# Altium schematic sheet 401_RPi0.SchDoc: RPi Zero Wireless
size A2; Organization: Greenfield Tech Solutions; Address1: Molendreef 33; Address2: Ossendrecht; Address3: 4641CS; Address4: The Netherlands; SheetNumber: 5; SheetTotal: 8
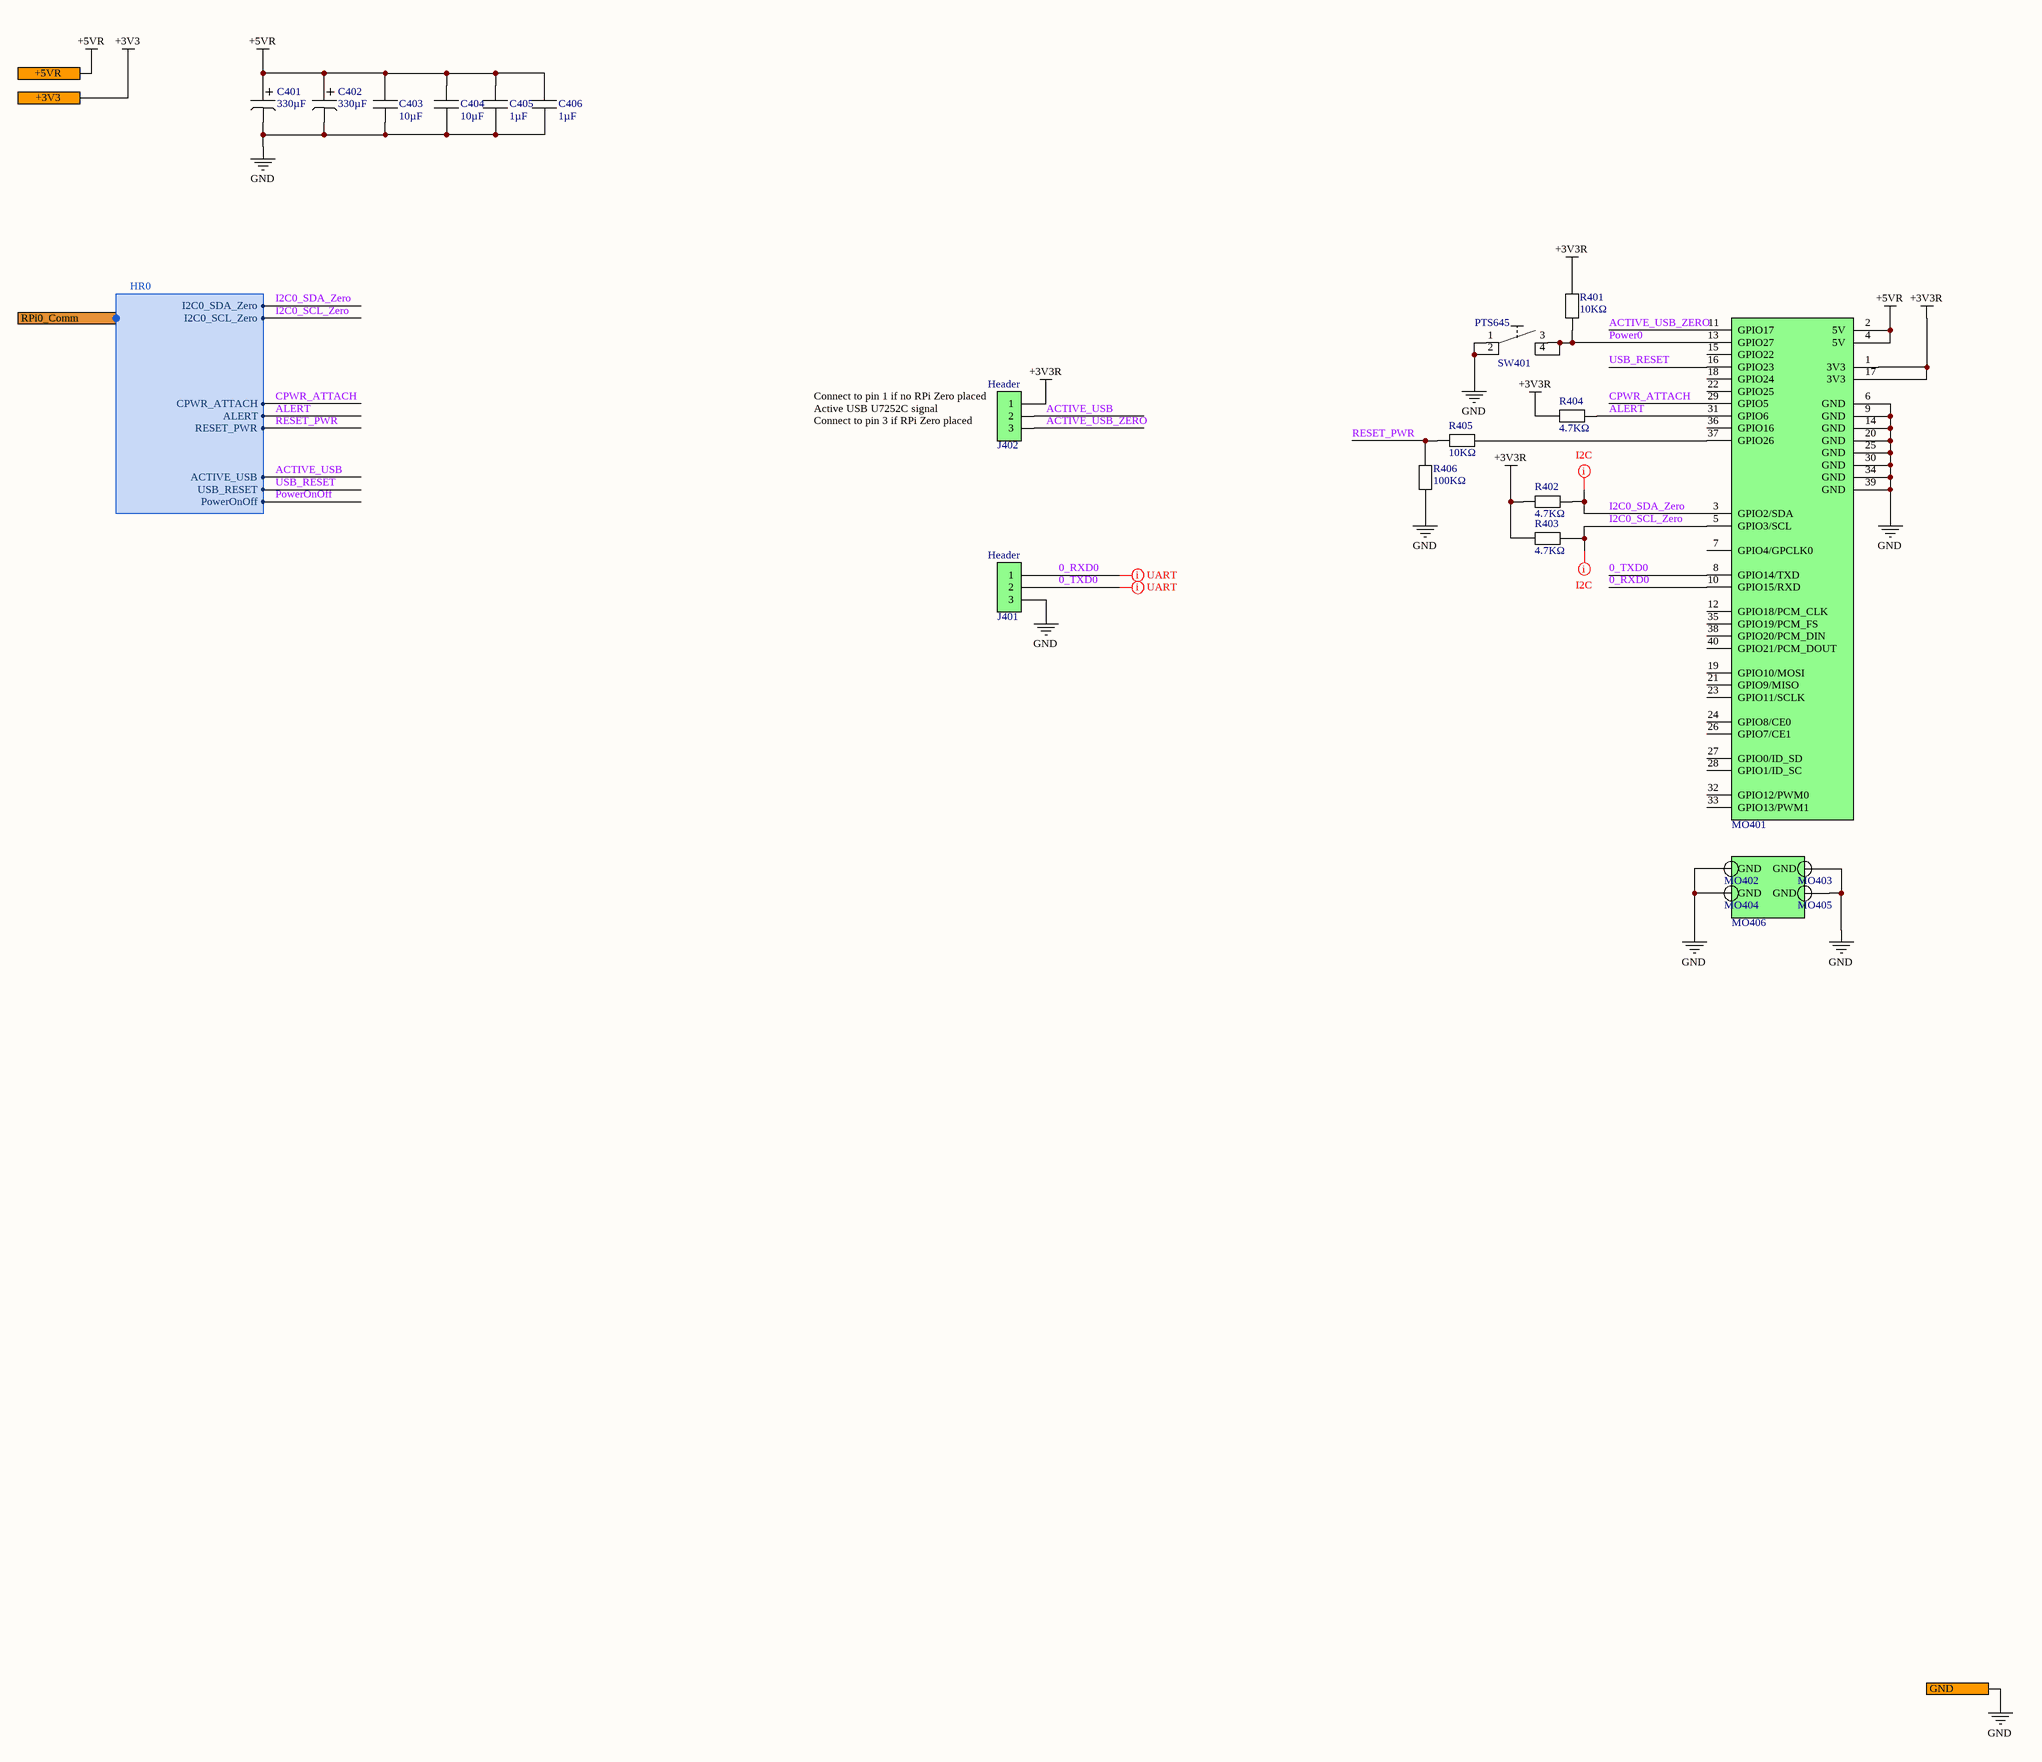
[diagram p0: 401_RPi0.SchDoc]

## Parts
C401  330µF  [EC_E7]
C402  330µF  [EC_E7]
C403  10µF  [C0805]
C404  10µF  [C0805]
C405  1µF  [C0603]
C406  1µF  [C0603]
J401  Header  [1X3P_2.54mm]
J402  Header  [1X3P_2.54mm]
MO401  ZeroW-1  [RPIZeroW_HeaderPins]  (value not drawn)
MO402  ZeroW-M  [CM4-M]  (value not drawn)
MO403  ZeroW-M  [CM4-M]  (value not drawn)
MO404  ZeroW-M  [CM4-M]  (value not drawn)
MO405  ZeroW-M  [CM4-M]  (value not drawn)
MO406  ZeroW  [RPIZeroW_Layout_Heightened]  (value not drawn)
R401  10KΩ  [R0402]
R402  4.7KΩ  [R0603]
R403  4.7KΩ  [R0603]
R404  4.7KΩ  [R0603]
R405  10KΩ  [R0402]
R406  100KΩ  [R0402]
SW401  PTS645  [PTS645-V]

## Ports
+3V3, +5VR, GND, RPi0_Comm (harness HR0)

## Harnesses
HR0: I2C0_SCL_Zero, I2C0_SDA_Zero, CPWR_ATTACH, PowerOnOff, USB_RESET, ACTIVE_USB, ALERT, RESET_PWR

## Nets
+3V3: port +3V3
+3V3R: J402.1 MO401.1(3V3) MO401.17(3V3) R401.2 R402.1 R403.1 R404.1
+5VR: C401.1 C402.1 C403.1 C404.1 C405.1 C406.1 MO401.2(5V) MO401.4(5V) ; port +5VR
GND: C401.2 C402.2 C403.2 C404.2 C405.2 C406.2 J401.3 MO401.6(GND) MO401.9(GND) MO401.14(GND) MO401.20(GND) MO401.25(GND) MO401.30(GND) MO401.34(GND) MO401.39(GND) MO402.GND MO403.GND MO404.GND MO405.GND R406.1 SW401.1 SW401.2 ; port GND
0_RXD0: J401.1 MO401.10(GPIO15/RXD)
0_TXD0: J401.2 MO401.8(GPIO14/TXD)
ACTIVE_USB: J402.2 ; port RPi0_Comm.ACTIVE_USB
ACTIVE_USB_ZERO: J402.3 MO401.11(GPIO17)
ALERT: MO401.31(GPIO6) R404.2 ; port RPi0_Comm.ALERT
CPWR_ATTACH: MO401.29(GPIO5) ; port RPi0_Comm.CPWR_ATTACH
I2C0_SCL_Zero: MO401.5(GPIO3/SCL) R403.2 ; port RPi0_Comm.I2C0_SCL_Zero
I2C0_SDA_Zero: MO401.3(GPIO2/SDA) R402.2 ; port RPi0_Comm.I2C0_SDA_Zero
Power0: MO401.13(GPIO27) R401.1 SW401.3 SW401.4
PowerOnOff: port RPi0_Comm.PowerOnOff
RESET_PWR: R405.1 R406.2 ; port RPi0_Comm.RESET_PWR
USB_RESET: MO401.16(GPIO23) ; port RPi0_Comm.USB_RESET
NetMO401_37: MO401.37(GPIO26) R405.2

Not connected (* = marked no-connect by the designer): MO401 7(GPIO4/GPCLK0) 12(GPIO18/PCM_CLK) 15(GPIO22) 18(GPIO24) 19(GPIO10/MOSI) 21(GPIO9/MISO) 22(GPIO25) 23(GPIO11/SCLK) 24(GPIO8/CE0) 26(GPIO7/CE1) 27(GPIO0/ID_SD) 28(GPIO1/ID_SC) 32(GPIO12/PWM0) 33(GPIO13/PWM1) 35(GPIO19/PCM_FS) 36(GPIO16) 38(GPIO20/PCM_DIN) 40(GPIO21/PCM_DOUT)

## Layout directives
net class I2C_0: I2C0_SCL_Zero, I2C0_SDA_Zero
net class UART_0: 0_RXD0, 0_TXD0

## Notes on the sheet
- (near J402) Connect to pin 1 if no RPi Zero placed
- Active USB U7252C signal
- (near J402) Connect to pin 3 if RPi Zero placed
- Title
- Size:
- Date:
- File:
- A2
- Number:
- Time:
- Revision:
- Sheet
- of

## Library data of the parts
C401 C402 = CA0012: 330µF 16V 20% 16mΩ 4100mA; Part Number: CA0012; ManfactPart: 16SVPG330MX; ID: 12; RefVal: 330µF
C403 C404 = CA0001: 10µF 16V 10% X5R; Part Number: CA0001; ManfactPart: GRM21BR61C106KE15L; ID: 1; RefVal: 10µF
C405 C406 = CA0003: 1µF 16V 10% X5R; Part Number: CA0003; ManfactPart: C1608X5R1C105K080AA; ID: 3; RefVal: 1µF
J401 J402 = CO0018: Header 1x3P; Part Number: CO0018; ManfactPart: G800W305018EU; ID: 32; RefVal: Header
MO401 = MO0017: RPI ZeroW Header 1-40; Part Number: MO0017; ManfactPart: 9900002236265; ID: 17; RefVal: ZeroW-1
MO402-MO405 = MO0016: RPI ZeroW Mounting Studs; Part Number: MO0016; ManfactPart: 9774030151R; ID: 16; RefVal: ZeroW-M
MO406 = MO0022: Outline of ZeroW Heigthened P\lacement; Part Number: MO0022; ManfactPart: RPI Zero W; ID: 22; RefVal: ZeroW
R401 R405 = RS0011: 10KΩ 1% 62.5mW; Part Number: RS0011; ManfactPart: WR04X1002FTL; ID: 11; RefVal: 10KΩ
R402-R404 = RS0002: 4.7KΩ 1% 100mW; Part Number: RS0002; ManfactPart: WR06X4701FTL; ID: 2; RefVal: 4.7KΩ
R406 = RS0036: 100KΩ 1% 62.5mW 100PPM; Part Number: RS0036; ManfactPart: AC0402FR-13100KL; ID: 36; RefVal: 100KΩ
SW401 = SW0003: TACTILE SWITCH SPST; Part Number: SW0003; ManfactPart: PTS645VK832LFS; ID: 3; RefVal: PTS645